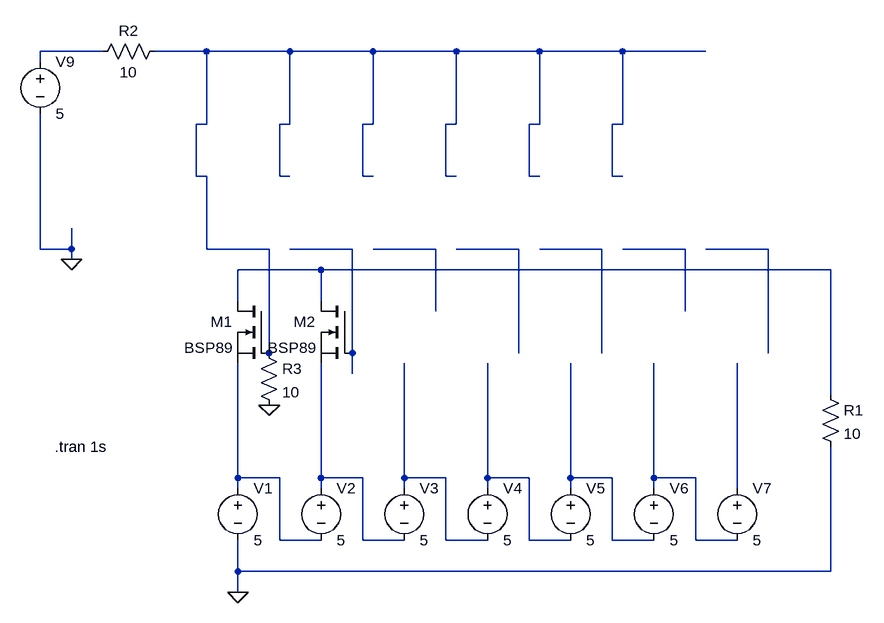
[diagram p0: schematic keyboard.asc]
keyboard.asc, the LTspice schematic file:
Version 4
SHEET 1 1252 680
WIRE -352 -288 -448 -288
WIRE -192 -288 -272 -288
WIRE -64 -288 -192 -288
WIRE 64 -288 -64 -288
WIRE 192 -288 64 -288
WIRE 320 -288 192 -288
WIRE 448 -288 320 -288
WIRE 576 -288 448 -288
WIRE -448 -272 -448 -288
WIRE -192 -176 -192 -288
WIRE -192 -176 -208 -176
WIRE -64 -176 -64 -288
WIRE -64 -176 -80 -176
WIRE 64 -176 64 -288
WIRE 64 -176 48 -176
WIRE 192 -176 192 -288
WIRE 192 -176 176 -176
WIRE 320 -176 320 -288
WIRE 320 -176 304 -176
WIRE 448 -176 448 -288
WIRE 448 -176 432 -176
WIRE -208 -96 -208 -176
WIRE -192 -96 -208 -96
WIRE -80 -96 -80 -176
WIRE -64 -96 -80 -96
WIRE 48 -96 48 -176
WIRE 64 -96 48 -96
WIRE 176 -96 176 -176
WIRE 192 -96 176 -96
WIRE 304 -96 304 -176
WIRE 320 -96 304 -96
WIRE 432 -96 432 -176
WIRE 448 -96 432 -96
WIRE -448 16 -448 -192
WIRE -400 16 -400 -16
WIRE -400 16 -448 16
WIRE -192 16 -192 -96
WIRE -96 16 -192 16
WIRE 32 16 -64 16
WIRE 160 16 64 16
WIRE 288 16 192 16
WIRE 416 16 320 16
WIRE 544 16 448 16
WIRE 672 16 576 16
WIRE -400 32 -400 16
WIRE -16 48 -144 48
WIRE 768 48 -16 48
WIRE -144 96 -144 48
WIRE -16 96 -16 48
WIRE 160 112 160 16
WIRE 544 112 544 16
WIRE -96 176 -96 16
WIRE 32 176 32 16
WIRE 288 176 288 16
WIRE 416 176 416 16
WIRE 672 176 672 16
WIRE 32 208 32 176
WIRE 768 240 768 48
WIRE -144 368 -144 192
WIRE -80 368 -144 368
WIRE -16 368 -16 192
WIRE 48 368 -16 368
WIRE 112 368 112 192
WIRE 176 368 112 368
WIRE 240 368 240 192
WIRE 304 368 240 368
WIRE 368 368 368 192
WIRE 432 368 368 368
WIRE 496 368 496 192
WIRE 560 368 496 368
WIRE -144 384 -144 368
WIRE -16 384 -16 368
WIRE 112 384 112 368
WIRE 240 384 240 368
WIRE 368 384 368 368
WIRE 496 384 496 368
WIRE 624 384 624 192
WIRE -80 464 -80 368
WIRE -16 464 -80 464
WIRE 48 464 48 368
WIRE 112 464 48 464
WIRE 176 464 176 368
WIRE 240 464 176 464
WIRE 304 464 304 368
WIRE 368 464 304 464
WIRE 432 464 432 368
WIRE 496 464 432 464
WIRE 560 464 560 368
WIRE 624 464 560 464
WIRE -144 512 -144 464
WIRE 768 512 768 320
WIRE 768 512 -144 512
WIRE -144 544 -144 512
FLAG -144 544 0
FLAG -400 32 0
FLAG -96 256 0
DATAFLAG -16 256 ""
DATAFLAG -128 16 ""
DATAFLAG 768 128 ""
SYMBOL voltage -144 368 R0
WINDOW 123 0 0 Left 0
WINDOW 39 0 0 Left 0
SYMATTR InstName V1
SYMATTR Value 5
SYMBOL voltage -16 368 R0
WINDOW 123 0 0 Left 0
WINDOW 39 0 0 Left 0
SYMATTR InstName V2
SYMATTR Value 5
SYMBOL voltage 112 368 R0
WINDOW 123 0 0 Left 0
WINDOW 39 0 0 Left 0
SYMATTR InstName V3
SYMATTR Value 5
SYMBOL voltage 240 368 R0
WINDOW 123 0 0 Left 0
WINDOW 39 0 0 Left 0
SYMATTR InstName V4
SYMATTR Value 5
SYMBOL voltage 368 368 R0
WINDOW 123 0 0 Left 0
WINDOW 39 0 0 Left 0
SYMATTR InstName V5
SYMATTR Value 5
SYMBOL voltage 496 368 R0
WINDOW 123 0 0 Left 0
WINDOW 39 0 0 Left 0
SYMATTR InstName V6
SYMATTR Value 5
SYMBOL voltage 624 368 R0
WINDOW 123 0 0 Left 0
WINDOW 39 0 0 Left 0
SYMATTR InstName V7
SYMATTR Value 5
SYMBOL voltage -448 -288 R0
WINDOW 123 0 0 Left 0
WINDOW 39 0 0 Left 0
SYMATTR InstName V9
SYMATTR Value 5
SYMBOL res -256 -304 R90
WINDOW 0 0 56 VBottom 2
WINDOW 3 32 56 VTop 2
SYMATTR InstName R2
SYMATTR Value 10
SYMBOL nmos -96 96 M0
SYMATTR InstName M1
SYMATTR Value BSP89
SYMBOL nmos 32 96 M0
SYMATTR InstName M2
SYMATTR Value BSP89
SYMBOL res 752 224 R0
SYMATTR InstName R1
SYMATTR Value 10
SYMBOL res -112 160 R0
SYMATTR InstName R3
SYMATTR Value 10
TEXT -426 320 Left 2 !.tran 1s

The netlist it stands for:
* keyboard.asc
V1 N010 0 5
V2 N011 N010 5
V3 N012 N011 5
V4 N013 N012 5
V5 N014 N013 5
V6 N015 N014 5
V7 N016 N015 5
V9 N001 0 5
R2 N002 N001 10
M1 N009 N002 N010 N010 BSP89
M2 N009 N003 N011 N011 BSP89
R1 N009 0 10
R3 N002 0 10
.model NMOS NMOS
.model PMOS PMOS
.lib standard.mos
.tran 1s
.backanno
.end